# EAGLE design stm32103c8t6-10x10-v1 (EAGLE 7.4.0)
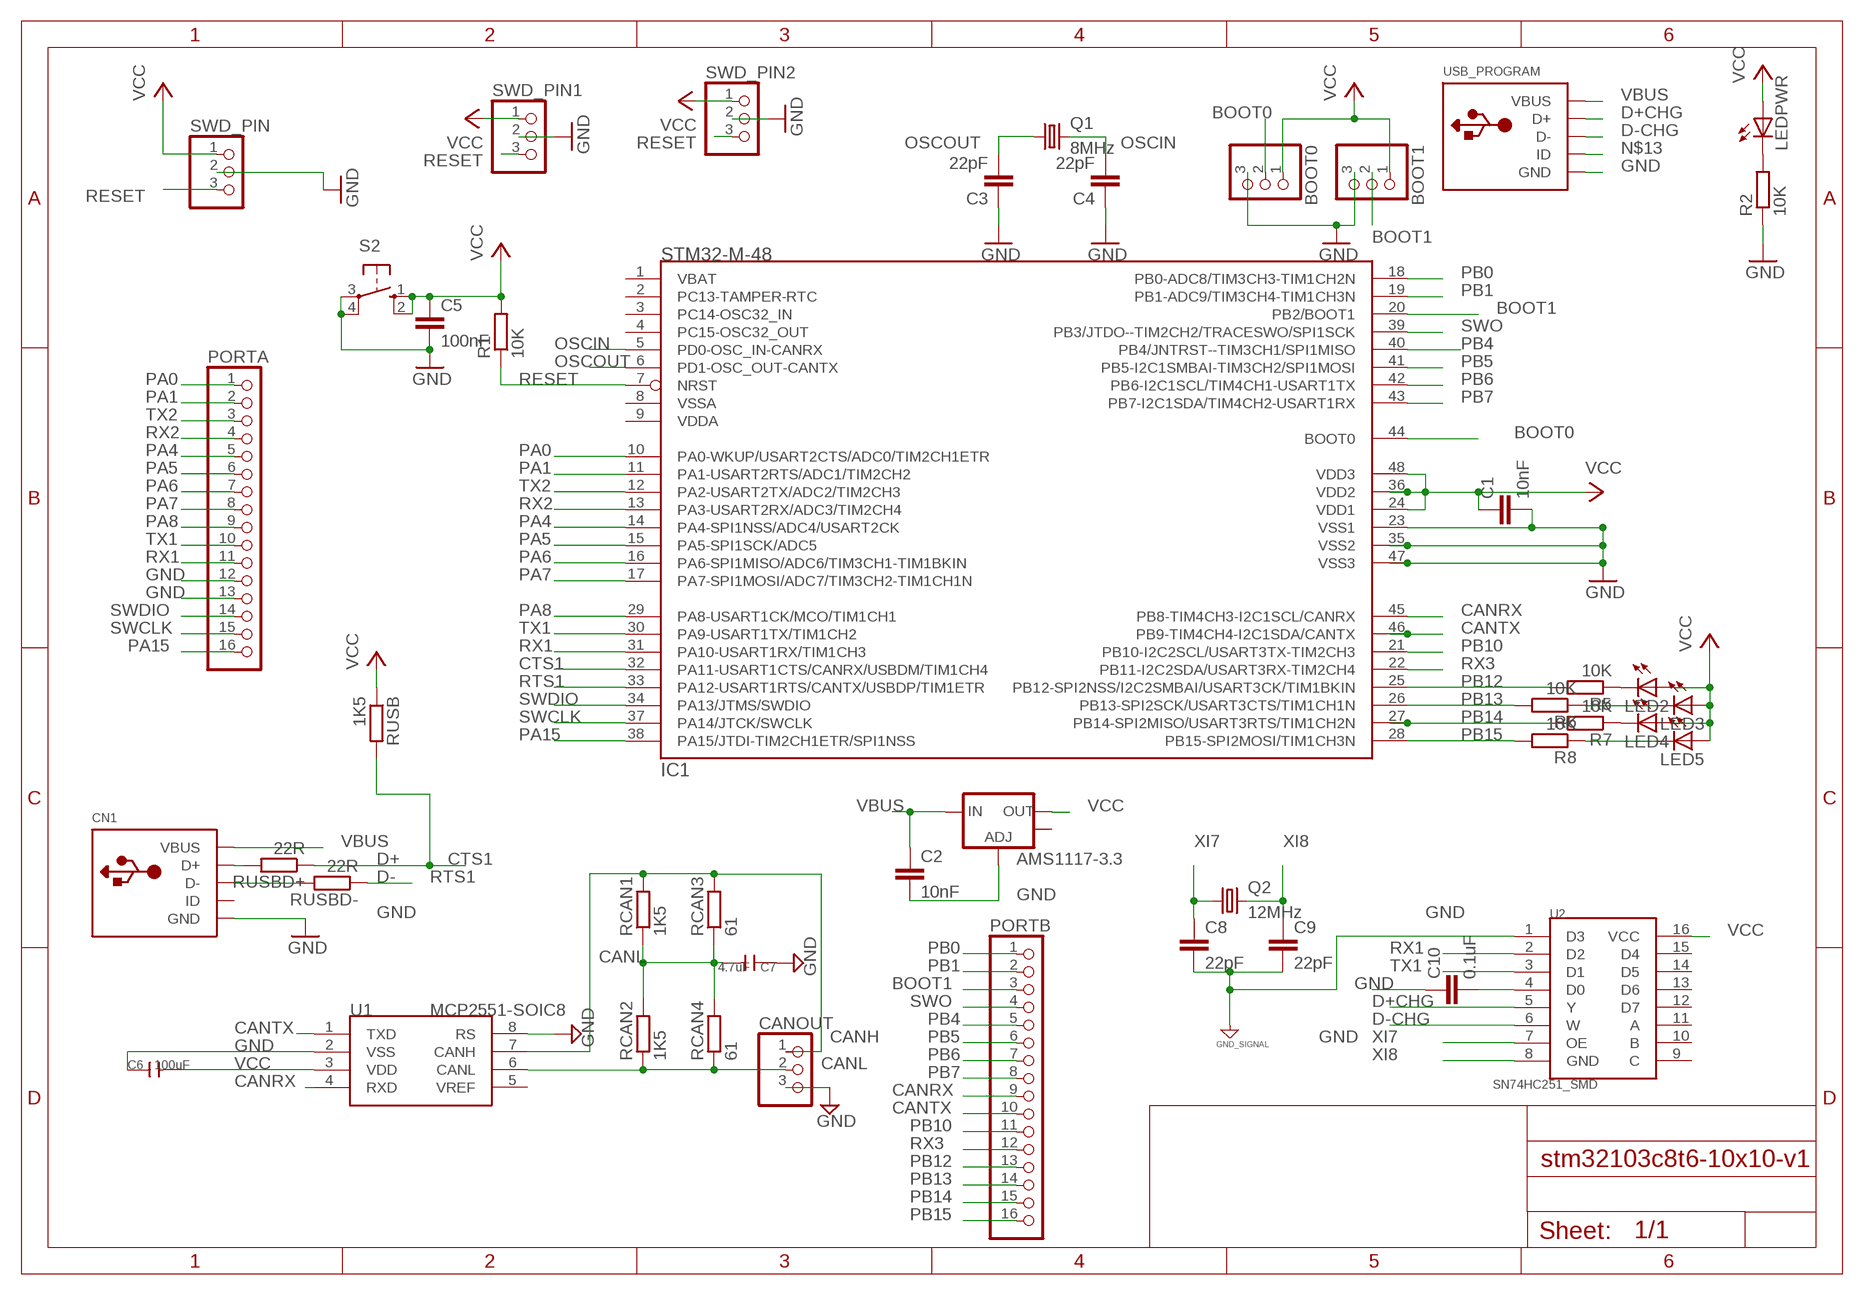
[diagram p0: schematic, sheet 1]

## Parts
AMS1117-3.3  V_REG_LM1117SOT223  [SOT223]
BOOT0  PINHD-1X3  [1X03]
BOOT1  PINHD-1X3  [1X03]
C1  10nF  C-EUC1210  [C1210]
C2  10nF  C-EUC1206  [C1206]
C3  22pF  C-EUC1210  [C1210]
C4  22pF  C-EUC1210  [C1210]
C5  100nF  C-EUC1206  [C1206]
C6  100uF  C-1206  [C1206]
C7  4.7uF  C-1206  [C1206]
C8  22pF  C-EUC1206  [C1206]
C9  22pF  C-EUC1206  [C1206]
C10  0.1uF  C-EUC1206  [C1206]
CANOUT  PINHD-1X3  [1X03]
CN1  USBTHM  [USB-MINIB-THM]
IC1  STM32-M-48  [LQFP48]
LED2  LEDSMT1206  [1206]
LED3  LEDSMT1206  [1206]
LED4  LEDSMT1206  [1206]
LED5  LEDSMT1206  [1206]
LEDPWR  LEDSMT1206  [1206]
PORTA  PINHD-1X16  [1X16]
PORTB  PINHD-1X16  [1X16]
Q1  8MHz  CRYSTALHC49S  [HC49/S]
Q2  12MHz  CRYSTALHC49S  [HC49/S]
R1  10K  R-EU_R1206  [R1206]
R2  10K  R-EU_R1206  [R1206]
R5  10K  R-EU_R1206  [R1206]
R6  10K  R-EU_R1206  [R1206]
R7  10K  R-EU_R1206  [R1206]
R8  10K  R-EU_R1206  [R1206]
RCAN1  1K5  R-EU_R1206  [R1206]
RCAN2  1K5  R-EU_R1206  [R1206]
RCAN3  61  R-EU_R1206  [R1206]
RCAN4  61  R-EU_R1206  [R1206]
RUSB  1K5  R-EU_R1206  [R1206]
RUSBD+  22R  R-EU_R1206  [R1206]
RUSBD-  22R  R-EU_R1206  [R1206]
S2  10-XX  [B3F-10XX]
SWD_PIN  PINHD-1X3  [1X03]
SWD_PIN1  PINHD-1X3  [1X03]
SWD_PIN2  PINHD-1X3  [1X03]
U1  MCP2551-SOIC8  [SOIC8-6.0]
U2  SN74HC251_SMD  [SO016]
USB_PROGRAM  USBTHM  [USB-MINIB-THM]

## Nets
BOOT0: BOOT0.2 IC1.44(BOOT0)
BOOT1: BOOT1.2 IC1.20(PB2/BOOT1) PORTB.3
CANH [CAN]: CANOUT.1 RCAN1.2 RCAN3.2 U1.7(CANH)
CANL [CAN]: CANOUT.2 RCAN2.1 RCAN4.1 U1.6(CANL)
CANRX: IC1.45(PB8-TIM4CH3-I2C1SCL/CANRX) PORTB.9 U1.4(RXD)
CANTX: IC1.46(PB9-TIM4CH4-I2C1SDA/CANTX) PORTB.10 U1.1(TXD)
CTS1: IC1.32(PA11-USART1CTS/CANRX/USBDM/TIM1CH4) RUSB.2 RUSBD+.1
D+: CN1.D+ RUSBD+.2
D+CHG: U2.5(Y) USB_PROGRAM.D+
D-: CN1.D- RUSBD-.2
D-CHG: U2.6(W) USB_PROGRAM.D-
GND [GND]: AMS1117-3.3.1(ADJ) BOOT0.3 BOOT1.3 C1.2 C2.2 C3.1 C4.1 C5.2 C6.1 C7.1 C8.2 C9.2 C10.1 CANOUT.3 CN1.GND IC1.23(VSS1) IC1.35(VSS2) IC1.47(VSS3) PORTA.12 PORTA.13 R2.1 S2.3(P) S2.4(P1) SWD_PIN1.2 SWD_PIN2.2 SWD_PIN.2 U1.2(VSS) U1.8(RS) U2.1(D3) USB_PROGRAM.GND ; supply symbol labelled GND_SIGNAL
N$4: LEDPWR.C R2.2
N$6: LED2.C R5.1
N$7: LED3.C R6.1
N$8: LED4.C R7.1
N$9: LED5.C R8.1
N$11: C10.2 U2.4(D0)
N$13: USB_PROGRAM.ID
OSCIN: C4.2 IC1.5(PD0-OSC_IN-CANRX) Q1.2
OSCOUT: C3.2 IC1.6(PD1-OSC_OUT-CANTX) Q1.1
PA0: IC1.10(PA0-WKUP/USART2CTS/ADC0/TIM2CH1ETR) PORTA.1
PA1: IC1.11(PA1-USART2RTS/ADC1/TIM2CH2) PORTA.2
PA4: IC1.14(PA4-SPI1NSS/ADC4/USART2CK) PORTA.5
PA5: IC1.15(PA5-SPI1SCK/ADC5) PORTA.6
PA6: IC1.16(PA6-SPI1MISO/ADC6/TIM3CH1-TIM1BKIN) PORTA.7
PA7: IC1.17(PA7-SPI1MOSI/ADC7/TIM3CH2-TIM1CH1N) PORTA.8
PA8: IC1.29(PA8-USART1CK/MCO/TIM1CH1) PORTA.9
PA15: IC1.38(PA15/JTDI-TIM2CH1ETR/SPI1NSS) PORTA.16
PB0: IC1.18(PB0-ADC8/TIM3CH3-TIM1CH2N) PORTB.1
PB1: IC1.19(PB1-ADC9/TIM3CH4-TIM1CH3N) PORTB.2
PB4: IC1.40(PB4/JNTRST--TIM3CH1/SPI1MISO) PORTB.5
PB5: IC1.41(PB5-I2C1SMBAI-TIM3CH2/SPI1MOSI) PORTB.6
PB6: IC1.42(PB6-I2C1SCL/TIM4CH1-USART1TX) PORTB.7
PB7: IC1.43(PB7-I2C1SDA/TIM4CH2-USART1RX) PORTB.8
PB10: IC1.21(PB10-I2C2SCL/USART3TX-TIM2CH3) PORTB.11
PB12: IC1.25(PB12-SPI2NSS/I2C2SMBAI/USART3CK/TIM1BKIN) PORTB.13 R5.2
PB13: IC1.26(PB13-SPI2SCK/USART3CTS/TIM1CH1N) PORTB.14 R6.2
PB14: IC1.27(PB14-SPI2MISO/USART3RTS/TIM1CH2N) PORTB.15 R7.2
PB15: IC1.28(PB15-SPI2MOSI/TIM1CH3N) PORTB.16 R8.2
RESET: IC1.7(NRST) R1.1 SWD_PIN1.3 SWD_PIN2.3 SWD_PIN.3
RTS1: IC1.33(PA12-USART1RTS/CANTX/USBDP/TIM1ETR) RUSBD-.1
RX1: IC1.31(PA10-USART1RX/TIM1CH3) PORTA.11 U2.2(D2)
RX2: IC1.13(PA3-USART2RX/ADC3/TIM2CH4) PORTA.4
RX3: IC1.22(PB11-I2C2SDA/USART3RX-TIM2CH4) PORTB.12
SWCLK: IC1.37(PA14/JTCK/SWCLK) PORTA.15
SWDIO: IC1.34(PA13/JTMS/SWDIO) PORTA.14
SWO: IC1.39(PB3/JTDO--TIM2CH2/TRACESWO/SPI1SCK) PORTB.4
TX1: IC1.30(PA9-USART1TX/TIM1CH2) PORTA.10 U2.3(D1)
TX2: IC1.12(PA2-USART2TX/ADC2/TIM2CH3) PORTA.3
UNIC: C7.2 RCAN1.1 RCAN2.2 RCAN3.1 RCAN4.2
VBUS: AMS1117-3.3.3(IN) C2.1 CN1.VBUS USB_PROGRAM.VBUS
VCC [POWER]: AMS1117-3.3.2(OUT) BOOT0.1 BOOT1.1 C1.1 C5.1 C6.2 IC1.24(VDD1) IC1.36(VDD2) IC1.48(VDD3) LED2.A LED3.A LED4.A LED5.A LEDPWR.A R1.2 RUSB.1 S2.1(S) S2.2(S1) SWD_PIN1.1 SWD_PIN2.1 SWD_PIN.1 U1.3(VDD) U2.16(VCC)
XI7: C8.1 Q2.1 U2.7(OE)
XI8: C9.1 Q2.2 U2.8(GND)
Unconnected: AMS1117-3.3.4(OUT) CN1.ID IC1.1(VBAT) IC1.2(PC13-TAMPER-RTC) IC1.3(PC14-OSC32_IN) IC1.4(PC15-OSC32_OUT) IC1.8(VSSA) IC1.9(VDDA) U1.5(VREF) U2.9(C) U2.10(B) U2.11(A) U2.12(D7) U2.13(D6) U2.14(D5) U2.15(D4)

## Library data of the parts
AMS1117-3.3 = SparkFun-PowerIC:V_REG_LM1117: Voltage Regulator LM1117 Standard adjustable voltage regulator but in SMD form. Spark Fun Electronics SKU : COM-00595
BOOT0 BOOT1 CANOUT SWD_PIN SWD_PIN1 SWD_PIN2 = pinhead:PINHD-1X3: PIN HEADER
C1-C5 C8-C10 = rcl:C-EU: CAPACITOR, European symbol
C6 C7 = Discrete:C*: Ceramic Capacitors
CN1 USB_PROGRAM = adafruit:USB: USB Connectors USBMINIB - Surface Mount Female Mini-B USB Connector 4UConnector: 06564 By microbuilder.eu Thru-hole RA Female Mini-B USB Connector 4UConnector: 18732 By ladyada.net
IC1 = pel_stm32:STM32-M-48: STM32F103 Medium Density 48pins
LED2-LED5 LEDPWR = led:LED: LED OSRAM: - CHIPLED LG R971, LG N971, LY N971, LG Q971, LY Q971, LO R971, LY R971 LH N974, LH R974 LS Q976, LO Q976, LY Q976 LO Q996 - Hyper CHIPLED LW Q18S LB Q993, LB Q99A, LB R99A - SideLED LS A670, LO A670, LY A670, LG A670, LP A670 LB A673, LV A673, LT A673, LW A673 LH A674 LY A675 LS A676, LA A676, LO A676, LY A676, LW A676 LS A679, LY A679, LG A679 - Hyper Micro SIDELED® LS Y876, LA Y876, LO Y876, LY Y876 LT Y87S - SmartLED LW L88C, LW L88S LB L89C, LB L89S, LG L890 LS L89K, LO L89K, LY L89K LS L896, LA L896, LO L896, LY L896 - TOPLED LS T670, LO T670, LY T670, LG T670, LP T670 LSG T670, LSP T670, LSY T670, LOP T670, LYG T670 LG T671, LOG T671, LSG T671 LB T673, LV T673, LT T673, LW T673 LH T674 LS T676, LA T676, LO T676, LY T676, LB T676, LH T676, LSB T676, LW T676 LB T67C, LV T67C, LT T67C, LS T67K, LO T67K, LY T67K, LW E67C LS E67B, LA E67B, LO E67B, LY E67B, LB E67C, LV E67C, LT E67C LW T67C LS T679, LY T679, LG T679 LS T770, LO T770, LY T770, LG T770, LP T770 LB T773, LV T773, LT T773, LW T773 LH T774 LS E675, LA E675, LY E675, LS T675 LS T776, LA T776, LO T776, LY T776, LB T776 LHGB T686 LT T68C, LB T68C - Hyper Mini TOPLED® LB M676 - Mini TOPLED Santana® LG M470 LS M47K, LO M47K, LY M47K Source: http://www.osram.convergy.de LUXEON: - LUMILED® LXK2-PW12-R00, LXK2-PW12-S00, LXK2-PW14-U00, LXK2-PW14-V00 LXK2-PM12-R00, LXK2-PM12-S00, LXK2-PM14-U00 LXK2-PE12-Q00, LXK2-PE12-R00, LXK2-PE12-S00, LXK2-PE14-T00, LXK2-PE14-U00 LXK2-PB12-K00, LXK2-PB12-L00, LXK2-PB12-M00, LXK2-PB14-N00, LXK2-PB14-P00, LXK2-PB14-Q00 LXK2-PR12-L00, LXK2-PR12-M00, LXK2-PR14-Q00, LXK2-PR14-R00 LXK2-PD12-Q00, LXK2-PD12-R00, LXK2-PD12-S00 LXK2-PH12-R00, LXK2-PH12-S00 LXK2-PL12-P00, LXK2-PL12-Q00, LXK2-PL12-R00 Source: www.luxeon.com KINGBRIGHT: KA-3528ASYC Source: www.kingbright.com
PORTA PORTB = pinhead:PINHD-1X16: PIN HEADER
Q1 Q2 = crystal:CRYSTAL: CRYSTAL; OC_FARNELL: 1667008; OC_NEWARK: unknown
R1 R2 R5-R8 RCAN1-RCAN4 RUSB RUSBD+ RUSBD- = resistor:R-EU_: RESISTOR, European symbol
S2 = switch-omron:10-XX: OMRON SWITCH; MPN: B3F-1000; OC_FARNELL: 176432; OC_NEWARK: 36M3542
U1 = IC:MCP2551: High-Speed CAN Transceiver http://ww1.microchip.com/downloads/en/devicedoc/21667f.pdf
U2 = SparkFun-DigitalIC:SN74HC251: SN54HC251 Data Selector/Multiplexer

## Net classes
0 default: clearance 0.205 mm
1 POWER: clearance 0.205 mm to class 0, clearance 0.205 mm
2 GND: clearance 0.205 mm to class 0, clearance 0.205 mm to class 1, clearance 0.205 mm
3 CAN: width 0.254 mm, clearance 0.205 mm to class 0, clearance 0.205 mm to class 1, clearance 0.205 mm to class 2, clearance 0.205 mm

## Board
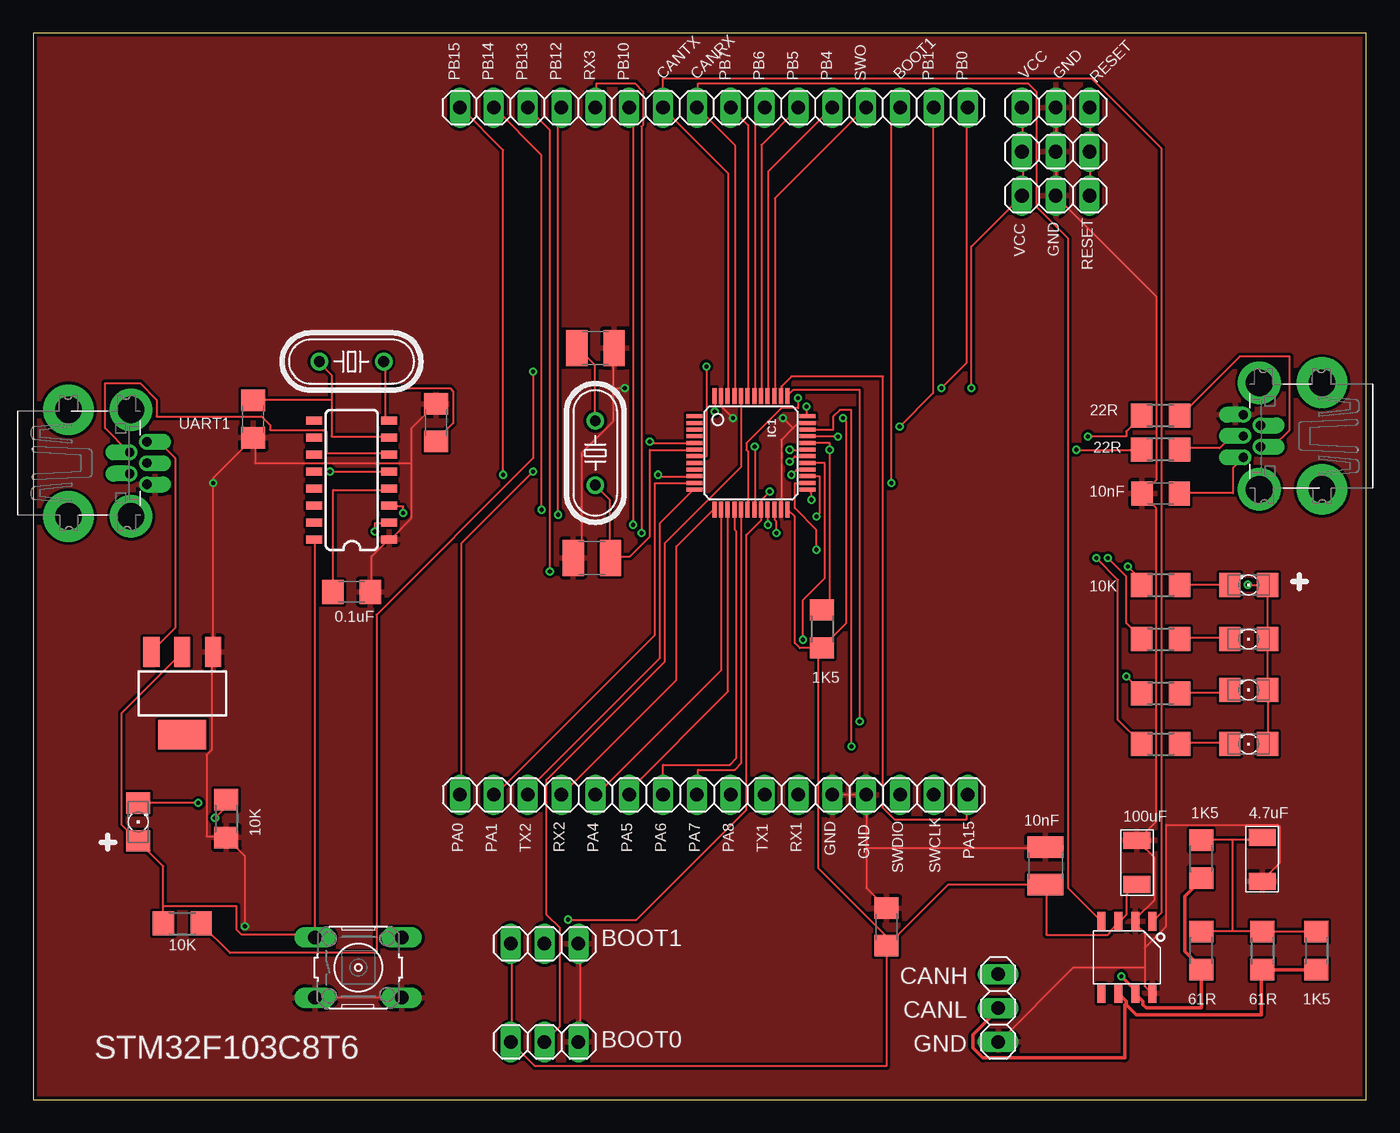
[diagram p1: board, top side]
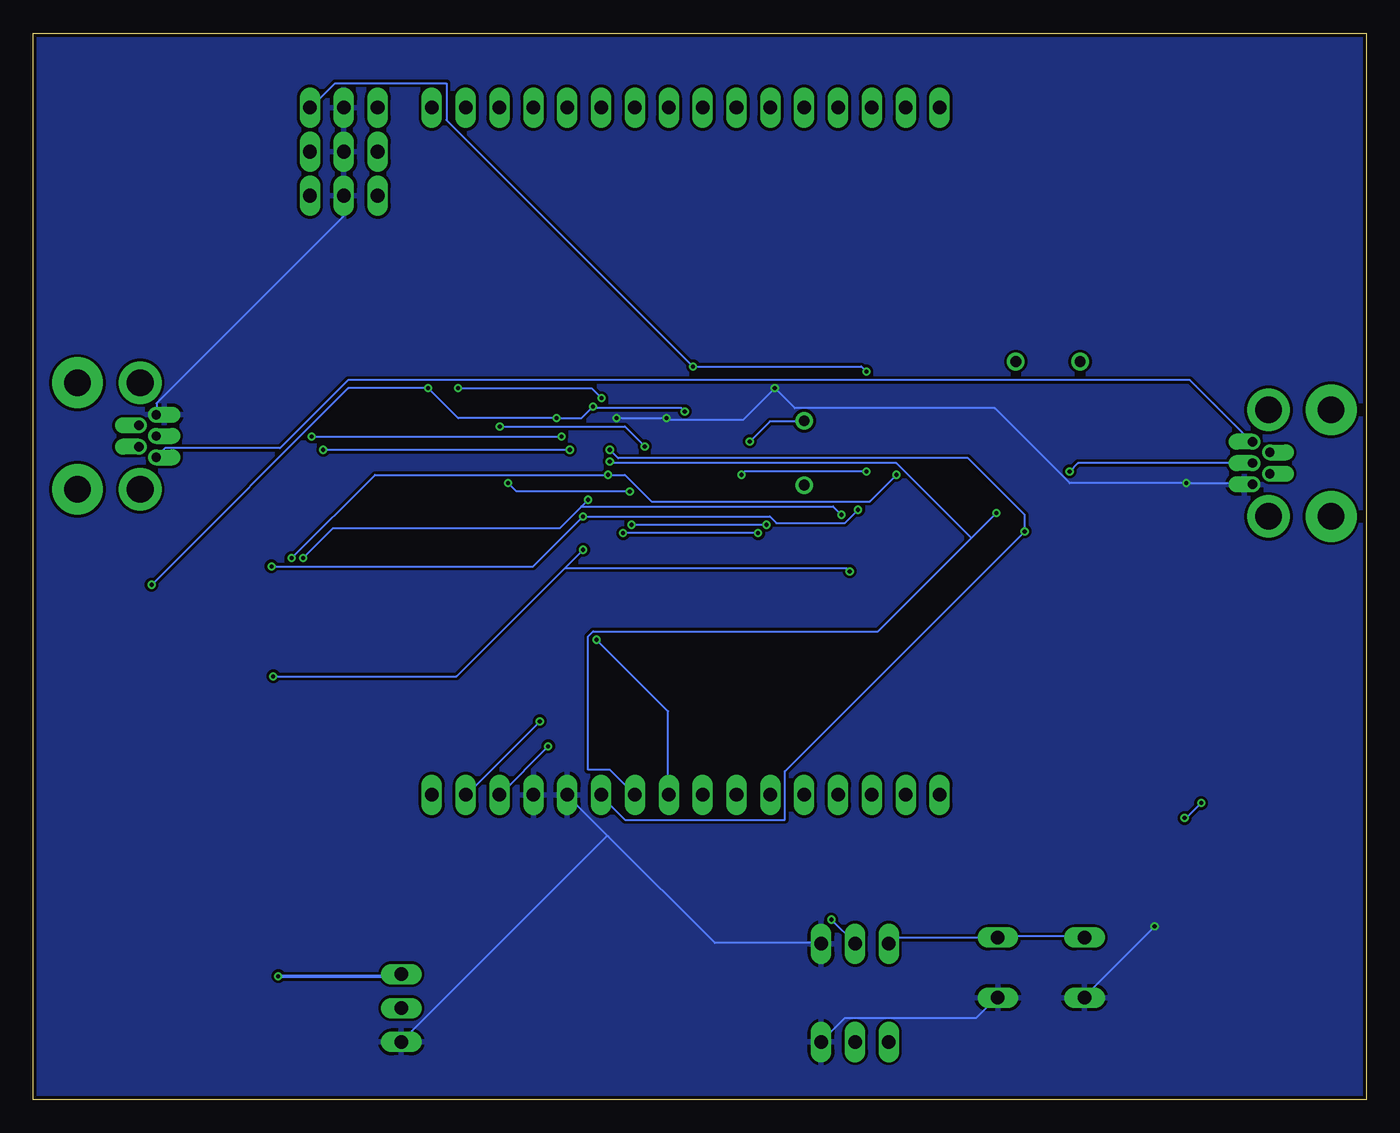
[diagram p2: board, bottom side, seen from below]

Size 100 x 80 mm. Coordinates in mm from the lower left corner, seen from the top.
Outline: 0,0 100,0 100,80 0,80 0,0
Copper layers (1*16): Top 0.035mm / dielectric 1.5mm / Bottom 0.035mm
Design rules "MakerStudio": minimum track width 6mil, minimum drill 12mil, track to track 6mil, track to pad 6mil, pad to pad 6mil, via to via 6mil, smd to smd 0mil, copper to edge 10mil, drill to drill 10mil, minimum pad ring 10mil, minimum via ring 6mil, stop-mask expansion 2mil, vias tented up to drill 100mil, thermal gap 10mil

### Footprints (pad centres in the part's own frame; a part is rotated, then mirrored left to right if it is on the bottom)
SOT223 = smd 1.219 x 2.235: 1 -2.311,-3.099; 2 0,-3.099; 3 2.311,-3.099 | smd 3.6 x 2.2: 4 0,3.099
1X03 = drill 1.016 long: 1 -2.54,0; 2 0,0; 3 2.54,0
C1210 = smd 1.6 x 2.7: 1 -1.4,0; 2 1.4,0
C1206 = smd 1.6 x 1.8: 1 -1.4,0; 2 1.4,0
C1206' = smd 1.27 x 2.032: 1 -1.651,0; 2 1.651,0
USB-MINIB-THM = drill 0.7 offset: D+ 0,9.8; D- -0.8,8.5; GND 1.6,9.8; ID 0.8,8.5; VBUS -1.6,9.8 | drill 2 pad 3.81: GND1 -4,3.9; GND4 4,3.9 | drill 2 pad 3.2: GND2 -4,8.6; GND3 4,8.6
LQFP48 = smd 0.3 x 1.2: 1 -2.75,-4.25; 2 -2.25,-4.25; 3 -1.75,-4.25; 4 -1.25,-4.25; 5 -0.75,-4.25; 6 -0.25,-4.25; 7 0.25,-4.25; 8 0.75,-4.25; 9 1.25,-4.25; 10 1.75,-4.25; 11 2.25,-4.25; 12 2.75,-4.25; 25 2.75,4.25; 26 2.25,4.25; 27 1.75,4.25; 28 1.25,4.25; 29 0.75,4.25; 30 0.25,4.25; 31 -0.25,4.25; 32 -0.75,4.25; 33 -1.25,4.25; 34 -1.75,4.25; 35 -2.25,4.25; 36 -2.75,4.25 | smd 1.2 x 0.3: 13 4.25,-2.75; 14 4.25,-2.25; 15 4.25,-1.75; 16 4.25,-1.25; 17 4.25,-0.75; 18 4.25,-0.25; 19 4.25,0.25; 20 4.25,0.75; 21 4.25,1.25; 22 4.25,1.75; 23 4.25,2.25; 24 4.25,2.75; 37 -4.25,2.75; 38 -4.25,2.25; 39 -4.25,1.75; 40 -4.25,1.25; 41 -4.25,0.75; 42 -4.25,0.25; 43 -4.25,-0.25; 44 -4.25,-0.75; 45 -4.25,-1.25; 46 -4.25,-1.75; 47 -4.25,-2.25; 48 -4.25,-2.75
1206 = smd 1.6 x 1.803: A -1.422,0; C 1.422,0
1X16 = drill 1.016 long: 1 -19.05,0; 2 -16.51,0; 3 -13.97,0; 4 -11.43,0; 5 -8.89,0; 6 -6.35,0; 7 -3.81,0; 8 -1.27,0; 9 1.27,0; 10 3.81,0; 11 6.35,0; 12 8.89,0; 13 11.43,0; 14 13.97,0; 15 16.51,0; 16 19.05,0
HC49/S = drill 0.813: 1 -2.413,0; 2 2.413,0
R1206 = smd 1.6 x 1.803: 1 -1.422,0; 2 1.422,0
B3F-10XX = drill 1.016 long: 1 -3.251,2.261; 2 3.251,2.261; 3 -3.251,-2.261; 4 3.251,-2.261
SOIC8-6.0 = smd 0.6 x 1.4: 1 -1.905,-2.7; 2 -0.635,-2.7; 3 0.635,-2.7; 4 1.905,-2.7; 5 1.905,2.7; 6 0.635,2.7; 7 -0.635,2.7; 8 -1.905,2.7
SO016 = smd 0.6 x 1.2: 1 -4.445,-2.8; 2 -3.175,-2.8; 3 -1.905,-2.8; 4 -0.635,-2.8; 5 0.635,-2.8; 6 1.905,-2.8; 7 3.175,-2.8; 8 4.445,-2.8; 9 4.445,2.8; 10 3.175,2.8; 11 1.905,2.8; 12 0.635,2.8; 13 -0.635,2.8; 14 -1.905,2.8; 15 -3.175,2.8; 16 -4.445,2.8

### Placement (x,y rotation side)
AMS1117-3.3  11.18,30.48 180 top
BOOT0  38.35,4.32 0 top
BOOT1  38.35,11.68 0 top
C1  75.95,17.53 90 top
C2  84.58,45.47 180 top
C3  41.91,40.64 0 top
C4  42.16,56.39 180 top
C5  64.01,12.95 90 top
C6  100uF  [C1206']  82.8,17.78 270 top
C7  4.7uF  [C1206']  92.2,18.03 90 top
C8  16.51,51.05 270 top
C9  30.23,50.8 90 top
C10  23.88,38.1 180 top
CANOUT  72.39,6.86 270 top
CN1  100.58,49.78 90 top
IC1  53.85,48.51 270 top
LED2  91.19,26.67 180 top
LED3  91.19,30.73 180 top
LED4  91.19,38.61 180 top
LED5  91.19,34.54 180 top
LEDPWR  7.87,20.83 90 top
PORTA  51.05,22.86 0 top
PORTB  51.05,74.42 180 top
Q1  42.16,48.51 90 top
Q2  23.88,55.37 0 top
R1  11.18,13.21 180 top
R2  14.48,21.08 90 top
R5  84.58,26.67 180 top
R6  84.58,30.48 180 top
R7  84.58,38.61 180 top
R8  84.58,34.54 180 top
RCAN1  87.63,18.03 270 top
RCAN2  96.27,11.18 90 top
RCAN3  87.63,11.18 270 top
RCAN4  92.2,11.18 90 top
RUSB  59.18,35.31 90 top
RUSBD+  84.58,48.77 0 top
RUSBD-  84.58,51.31 0 top
S2  24.38,9.91 0 top
SWD_PIN  76.71,74.42 0 top
SWD_PIN1  76.71,71.12 0 top
SWD_PIN2  76.71,67.82 0 top
U1  82.04,10.67 180 top
U2  23.88,46.48 90 top
USB_PROGRAM  -1.27,47.75 270 top

### Tracks (layer width: path | path; a pad name or v marks a point on that pad's centre or on a via)
BOOT0
  Top 0.152: IC1.44 53.12,52.75 53.12,47.5 47.38,41.75 47.38,32.88 38.5,24 38.5,13.88 39.5,12.88 39.5,5.5 38.38,4.38 BOOT0.2
BOOT1  (via drill 0.3)
  Top 0.152: v40.12,13.5 45.25,13.5 53.5,21.75 53.5,42.38 54.62,43.5 54.62,44.25 IC1.20 54.62,44.38 54.62,45 v55.25,45.62 | v64.38,46.25 64.38,73.75 65,74.38 PORTB.3
  Bottom 0.152: v40.12,13.5 38.38,11.75 BOOT1.2 | v64.38,46.25 63.75,45.62 v55.25,45.62
CANH  (via drill 0.3)
  Top 0.254: RCAN1.2 87.62,16.5 86.38,15.25 86.38,11.12 87.62,9.88 RCAN3.2 87.62,6.88 83.5,6.88 83.25,7.12 83.25,7.38 82.75,7.88 U1.7 82.62,8 82.62,8.25 v81.62,9.25
  Bottom 0.254: v81.62,9.25 72.62,9.25 72.5,9.38 CANOUT.1
CANL
  Top 0.254: U1.6 82,7.38 82,7.12 | 82,7.12 82.75,6.38 92.12,6.38 92.12,9.75 RCAN4.1 92.25,9.75 96.25,9.75 RCAN2.1 | CANOUT.2 72.38,6.75 70.5,4.88 70.5,3.88 71.25,3.12 81.88,3.12 81.88,7.12 82,7.12
CANRX
  Top 0.152: IC1.45 52.62,52.88 52.62,71.62 49.88,74.38 PORTB.9 49.88,74.5 49.88,76.25 74.62,76.25 75.25,75.62 75.25,67 77.62,64.62 77.62,15.88 80.12,13.38 U1.4
CANTX
  Top 0.152: IC1.46 52.12,52.88 52.12,69.5 47.25,74.38 PORTB.10 47.25,74.5 47.25,76.62 79.38,76.62 84.62,71.38 84.62,14 84,13.38 U1.1
CTS1  (via drill 0.3)
  Top 0.152: IC1.32 58.12,49.25 59.75,49.25 v59.75,48.75 59.75,37.25 59.25,36.75 RUSB.2 | v78.25,48.75 83.12,48.75 RUSBD+.1
  Bottom 0.152: v59.75,48.75 v78.25,48.75
D+
  Top 0.152: RUSBD+.2 86.12,48.88 89,48.88 89.88,49.75 90.75,49.75 CN1.D+
D+CHG  (via drill 0.3)
  Top 0.152: v22.25,47.12 26.62,47.12 U2.5
  Bottom 0.152: v22.25,47.12 21.62,47.75 8.62,47.75 USB_PROGRAM.D+
D-
  Top 0.152: RUSBD-.2 86.12,51.38 90.5,55.75 94.25,55.75 94.25,50.25 93,49 92.12,49 CN1.D-
D-CHG
  Top 0.152: U2.6 26.62,48.5 22,48.5 22,50.12 21.88,50.25 17.75,50.25 17.75,50.62 17.12,51.25 9.25,51.25 9.25,52.5 8,53.75 5.38,53.75 5.38,50.38 7.12,48.62 USB_PROGRAM.D-
GND  (via drill 0.3)
  Top 0.152: 57,50.38 57.38,50.75 58,50.75 IC1.35 | 57,50.38 56.12,49.5 56.12,44.38 IC1.23 | v52.5,51.12 51.62,52 51.62,52.75 IC1.47 | 57,50.38 v56.25,51.12 | 43.5,53.38 43.5,56.38 C4.1 | 43.5,53.38 43.5,50.88 41.12,48.5 41.12,41.25 40.62,40.75 C3.1 | 43.5,53.38 v44.38,53.38 | C10.1 25.38,38.12 25.38,40.75 26.62,42 U2.1 26.75,42 28.38,43.62 28.38,47.75 | 28.38,47.75 28.38,50.38 30.12,52.12 C9.2 | 28.38,47.75 16.62,47.75 16.62,49.62 C8.2 16.5,49.62 13.5,46.62 v13.5,46.25 13.5,33.62 AMS1117-3.3.1 13.38,33.5 13.38,26.25 13,25.88 13,19.75 14.38,19.75 R2.1 14.5,19.62 15.88,18.25 v15.88,13 | SWD_PIN.2 76.75,74.38 76.75,71.12 SWD_PIN1.2 76.75,71 76.75,67.88 SWD_PIN2.2 76.75,67.75 84.25,60.25 84.25,46.5 83.25,45.5 C2.2 83.25,45.38 84.25,44.38 84.25,20.88 82.88,19.5 C6.1 82.88,19.38 84.12,18.12 84.12,15 82.75,13.62 82.75,13.38 U1.2 82.75,13.25 82.75,13.12 83.38,12.5 83.38,11.38 | 83.38,11.38 83.38,9.88 | 83.38,9.88 83.38,8.5 83.88,8 U1.8 | 83.38,11.38 85,13 85,20.62 93.38,20.62 93.5,20.5 93.5,17.75 92.25,16.5 C7.1 | 83.38,9.88 78,9.88 72.5,4.38 CANOUT.3 | 62.5,18.88 62.5,22.75 PORTA.13 62.38,22.88 60,22.88 PORTA.12 | 62.5,18.88 62.5,15.88 64,14.38 C5.2 | 62.5,18.88 75.88,18.88 C1.2 | S2.3 21.25,7.62 27.62,7.62 S2.4 | BOOT0.3 41,4.38 41,11.62 BOOT1.3
  Bottom 0.152: v56.25,51.12 v52.5,51.12 52.38,51 46.75,51 v44.38,53.38 42.88,51.88 27.88,51.88 22.25,46.25 v13.5,46.25 8.62,46.25 USB_PROGRAM.GND | CN1.GND 90.75,51.5 90.75,52.25 76.75,66.25 76.75,67.75 SWD_PIN2.2 | S2.4 27.75,7.62 29.25,6.12 39.12,6.12 40.88,4.38 BOOT0.3 | 56.88,19.75 48.88,11.75 41,11.75 BOOT1.3 | 56.88,19.75 59.88,22.75 PORTA.12 | 56.88,19.75 57,19.75 72.38,4.38 CANOUT.3 | v15.88,13 21.12,7.75 S2.3
  pour Bottom: 0.25,79.76 99.82,79.76 99.82,0.25 0.25,0.25
  pour Top: 0.25,79.76 99.82,79.76 99.82,0.25 0.25,0.25
N$4  (via drill 0.3)
  Top 0.152: v12.38,22.25 LEDPWR.C | v13.62,21.12 14.38,21.88 14.38,22.5 R2.2
  Bottom 0.152: v12.38,22.25 13.5,21.12 v13.62,21.12
N$6
  Top 0.152: R5.1 86.12,26.75 89.75,26.75 LED2.C
N$7
  Top 0.152: R6.1 86.12,30.5 89.75,30.5 89.75,30.62 LED3.C
N$8
  Top 0.152: R7.1 86.12,38.62 89.75,38.62 LED4.C
N$9
  Top 0.152: R8.1 86.12,34.62 89.75,34.62 LED5.C
N$11
  Top 0.152: U2.4 26.62,45.75 22.5,45.75 22.5,38.12 C10.2
OSCIN  (via drill 0.3)
  Top 0.152: v46.25,49.38 46.25,49.25 49.5,49.25 IC1.5 | C4.2 40.88,56.38 42.12,55.12 42.12,51 Q1.2
  Bottom 0.152: v46.25,49.38 44.75,50.88 42.25,50.88 Q1.2
OSCOUT
  Top 0.152: IC1.6 49.5,48.75 46.25,48.75 46.25,42.25 44.75,40.75 43.38,40.75 C3.2 43.25,40.75 43.25,45 42.25,46 Q1.1
PA0  (via drill 0.3)
  Top 0.152: v46.88,46.88 46.88,46.75 49.5,46.75 IC1.10 | v37.5,47.12 32.12,41.75 32.12,22.88 PORTA.1
  Bottom 0.152: v46.88,46.88 46.62,47.12 v37.5,47.12
PA1
  Top 0.152: IC1.11 49.5,46.25 46.62,46.25 46.62,34.88 34.62,22.88 PORTA.2
PA4
  Top 0.152: IC1.14 51.62,44.25 51.62,32.25 42.25,22.88 PORTA.5
PA5
  Top 0.152: IC1.15 52.12,44.25 52.12,30.62 44.75,23.25 44.75,22.88 PORTA.6
PA6
  Top 0.152: IC1.16 52.62,44.25 52.62,42.75 52.75,42.62 52.75,25.62 52.25,25.12 47.25,25.12 47.25,22.88 PORTA.7
PA7
  Top 0.152: IC1.17 53.12,44.25 53.12,25.25 52.62,24.75 49.88,24.75 49.88,22.88 PORTA.8
PA8  (via drill 0.3)
  Top 0.152: v57.75,34.5 57.75,37.5 59.38,39.12 59.38,47.75 58.12,47.75 IC1.29
  Bottom 0.152: v57.75,34.5 52.38,29.12 52.38,22.88 PORTA.9
PA15
  Top 0.152: IC1.38 56.12,52.88 56.12,53.5 56.88,54.25 63.75,54.25 63.75,21.88 64.62,21 70,21 70,22.75 PORTA.16
PB0  (via drill 0.3)
  Top 0.152: v57.38,52.62 57.38,51.88 56.12,51.88 53.5,49.25 53.5,48.75 53.62,48.62 53.62,44.38 IC1.18 | v68.12,53.38 70,55.25 70,74.38 PORTB.1
  Bottom 0.152: v57.38,52.62 58.12,53.38 v68.12,53.38
PB1  (via drill 0.3)
  Top 0.152: v54.12,49 54.12,44.38 IC1.19 | v65,50.5 67.5,53 67.5,74.38 PORTB.2
  Bottom 0.152: v54.12,49 55.62,50.5 v65,50.5
PB4
  Top 0.152: IC1.40 55.12,52.88 55.12,69.62 59.88,74.38 PORTB.5
PB5
  Top 0.152: IC1.41 54.62,52.88 54.62,71.62 57.38,74.38 PORTB.6
PB6
  Top 0.152: IC1.42 54.12,52.88 54.12,73.75 54.75,74.38 PORTB.7
PB7
  Top 0.152: IC1.43 53.62,52.88 53.62,73.12 52.38,74.38 PORTB.8
PB10  (via drill 0.3)
  Top 0.152: v55.12,43.12 55.12,44.25 IC1.21 | v45,43.12 45,74.12 44.75,74.38 PORTB.11
  Bottom 0.152: v45,43.12 v55.12,43.12
PB12  (via drill 0.3)
  Top 0.152: v58.38,45 58.38,45.5 58.12,45.75 IC1.25 | v79.75,40.62 81.38,39 81.38,28.5 83.12,26.75 R5.2 | v39.38,43.88 39.38,74.25 39.5,74.38 PORTB.13
  Bottom 0.152: 58.88,44.5 60.5,42.88 77.5,42.88 v79.75,40.62 | 58.88,44.5 v58.38,45 | v39.38,43.88 40,44.5 58.88,44.5
PB13  (via drill 0.3)
  Top 0.152: v58.75,41.25 58.75,42.75 57.12,44.38 57.12,46.25 58,46.25 IC1.26 | v82,31.75 83.12,30.62 83.12,30.5 R6.2 | v38.75,39.62 38.75,72.75 37.12,74.38 PORTB.14
  Bottom 0.152: 60.12,39.88 68.25,31.75 v82,31.75 | 60.12,39.88 v58.75,41.25 | v38.75,39.62 39,39.88 60.12,39.88
PB14  (via drill 0.3)
  Top 0.152: v58.75,43.75 59,44 59,46.75 58.12,46.75 IC1.27 | v82.12,40 83.12,39 83.12,38.62 R7.2 | v38.12,44.25 38.12,70.88 34.62,74.38 PORTB.15
  Bottom 0.152: v82.12,40 62.5,40 v58.75,43.75 44.75,43.75 44.25,43.25 39.12,43.25 v38.12,44.25
PB15  (via drill 0.3)
  Top 0.152: v56.88,46.88 57.25,47.25 58,47.25 IC1.28 | v80.62,40.62 82,39.25 82,35.75 83.12,34.62 R8.2 | v35.25,46.88 35.25,71.25 32.12,74.38 PORTB.16
  Bottom 0.152: v80.62,40.62 74.38,46.88 v56.88,46.88 55.62,46.88 53.62,44.88 37.25,44.88 v35.25,46.88
RESET  (via drill 0.3)
  Top 0.152: SWD_PIN2.3 79.25,67.88 79.25,71 SWD_PIN1.3 79.25,74.38 SWD_PIN.3 | v50.5,55 50.5,48.25 49.62,48.25 IC1.7 | v37.5,54.62 37.5,48.12 25.75,36.38 25.75,11 14.75,11 12.62,13.12 R1.1
  Bottom 0.152: SWD_PIN.3 79.12,74.5 77.38,76.25 69,76.25 69,73.5 v50.5,55 37.88,55 v37.5,54.62
RTS1  (via drill 0.3)
  Top 0.152: v60.38,49.75 58.12,49.75 IC1.33 | v79.12,49.75 82,49.75 82,50.12 83.12,51.25 RUSBD-.1
  Bottom 0.152: v79.12,49.75 v60.38,49.75
RX1  (via drill 0.3)
  Top 0.152: v25.62,42.62 25.62,43.25 26.62,43.25 U2.2 | v56.75,48.75 58,48.75 IC1.31
  Bottom 0.152: PORTA.11 57.38,22.75 55.62,21 43.62,21 43.62,24.62 v25.62,42.62 25.62,43.88 29.88,48.12 56.12,48.12 v56.75,48.75
RX2
  Top 0.152: IC1.13 51,44.25 48.25,41.5 48.25,31.5 39.62,22.88 PORTA.4
RX3  (via drill 0.3)
  Top 0.152: v55.75,42.5 55.75,43.38 55.62,43.5 55.62,44.25 IC1.22 | v45.62,42.5 45.62,73 45.75,73.12 45.75,75.62 45.12,76.25 42.25,76.25 42.25,74.5 PORTB.12
  Bottom 0.152: v45.62,42.5 v55.75,42.5
SWCLK  (via drill 0.3)
  Top 0.152: v62,28.38 62,53.25 57,53.25 56.62,52.88 IC1.37
  Bottom 0.152: v62,28.38 67.5,22.88 PORTA.15
SWDIO  (via drill 0.3)
  Top 0.152: v61.38,26.5 61.38,51.75 60.5,51.75 60,51.25 60,50.25 58.12,50.25 IC1.34
  Bottom 0.152: v61.38,26.5 65,22.88 PORTA.14
SWO
  Top 0.152: IC1.39 55.62,52.88 55.62,67.62 62.38,74.38 PORTB.4
TX1  (via drill 0.3)
  Top 0.152: v27.75,44 27.75,44.5 26.75,44.5 U2.3 | v56.75,47.88 57.12,48.25 58,48.25 IC1.30
  Bottom 0.152: 29.62,42.12 36.62,35.12 58,35.12 58.38,34.75 58.38,24.75 56.75,24.75 54.88,22.88 PORTA.10 | 29.62,42.12 v27.75,44 | v56.75,47.88 56.62,47.75 35.25,47.75 29.62,42.12
TX2
  Top 0.152: IC1.12 49.5,45.75 47,43.25 47,33.12 37.12,23.25 37.12,22.88 PORTA.3
UNIC
  Top 0.152: 90,19.5 92.12,19.5 92.12,19.62 C7.2 | 90,19.5 87.75,19.5 RCAN1.1 | 90,12.62 92.12,12.62 RCAN4.2 92.25,12.62 96.25,12.62 RCAN2.2 | 90,12.62 87.75,12.62 RCAN3.1 | 90,12.62 90,19.5
VBUS
  Top 0.152: C2.1 86,45.5 90,45.5 90,47.38 90.75,48.12 CN1.VBUS | AMS1117-3.3.3 8.88,33.62 10.62,35.38 10.62,48.12 9.5,49.25 8.62,49.25 USB_PROGRAM.VBUS
  Bottom 0.152: CN1.VBUS 90.75,48.25 90.12,48.88 81.5,48.88 76.38,54 13.25,54 8.62,49.38 USB_PROGRAM.VBUS
VCC  (via drill 0.3)
  Top 0.152: 9.75,14.5 9.75,13.25 R1.2 | 9.75,14.5 9.75,17.5 7.88,19.38 LEDPWR.A 7.75,19.5 6.62,20.62 6.62,29 11.12,33.5 AMS1117-3.3.2 | BOOT1.1 35.88,11.62 35.88,4.38 BOOT0.1 35.88,4.25 37.62,2.5 64,2.5 64,11.5 C5.1 | 21.12,12.38 21.12,12.25 S2.1 21.12,12.38 | 21.12,12.38 21.12,42 U2.16 | 9.75,14.5 15.25,14.5 15.25,12.75 15.62,12.38 21.12,12.38 | C6.2 82.75,16.12 82,15.38 82,13.88 81.5,13.38 U1.3 81.38,13.25 80.75,12.62 80.75,12.5 80.62,12.38 76,12.38 76,16.12 C1.1 75.88,16.12 68.62,16.12 64.38,11.88 | 64.38,11.88 64.12,11.62 C5.1 | LED2.A 92.62,26.75 92.62,30.62 LED3.A 92.62,30.75 92.62,34.5 LED5.A 92.62,34.62 92.62,38.5 LED4.A 92.5,38.62 v91.12,38.62 | SWD_PIN.1 74.25,74.38 74.25,71.12 SWD_PIN1.1 74.25,71 74.25,67.88 SWD_PIN2.1 74.12,67.75 70.38,64 v70.38,53.38 | v58,52 58,51.38 IC1.36 | v51.12,51.62 51.12,52.75 IC1.48 | 58.88,33.88 59.12,33.88 RUSB.1 | 58.88,33.88 57.5,33.88 57.12,34.25 57.12,43.75 56.62,44.25 IC1.24 | v60.75,51.12 61,50.88 61,35.75 59.25,34 RUSB.1 | 64.38,11.88 58.88,17.38 58.88,33.88 | 64.38,11.88 C5.1 | 58.88,33.88 RUSB.1
  Bottom 0.152: S2.1 21.25,12.25 27.62,12.25 S2.2 27.75,12.12 35.38,12.12 35.75,11.75 BOOT1.1 | v51.12,51.62 51.38,51.88 57.88,51.88 v58,52 58.88,51.12 v60.75,51.12 68.12,51.12 v70.38,53.38 76.38,53.38 v91.12,38.62
XI7
  Top 0.152: 22.38,52.5 22.38,54.38 21.5,55.25 Q2.1 | 22.38,52.5 22.38,49.75 26.62,49.75 U2.7 | 22.38,52.5 16.62,52.5 C8.1
XI8
  Top 0.152: 26.38,53.38 26.38,55.25 Q2.2 | 26.38,53.38 26.38,51.25 26.62,51 U2.8 | 26.38,53.38 31.25,53.38 31.5,53.12 31.5,50.75 30.25,49.5 C9.1

### Text on the board
tNames: PB15 | PB14 | PB13 | PB12 | RX3 | PB10 | CANTX | CANRX | PB7 | PB6 | PB5 | PB4 | SWO | BOOT1 | PB1 | PB0 | VCC | GND | RESET | VCC | GND | RESET | 22R | UART1 | 22R | 10nF | 10K | 0.1uF | 1K5 | 10K | 10nF | 100uF | 1K5 | 4.7uF | PA0 | PA1 | TX2 | RX2 | PA4 | PA5 | PA6 | PA7 | PA8 | TX1 | RX1 | GND | GND | PA15 | SWDIO | SWCLK | 10K | CANH | 61R | 61R | 1K5 | CANL | GND | STM32F103C8T6